# EAGLE schematic P14-ON-Off_Programmable (EAGLE 9.6.2)
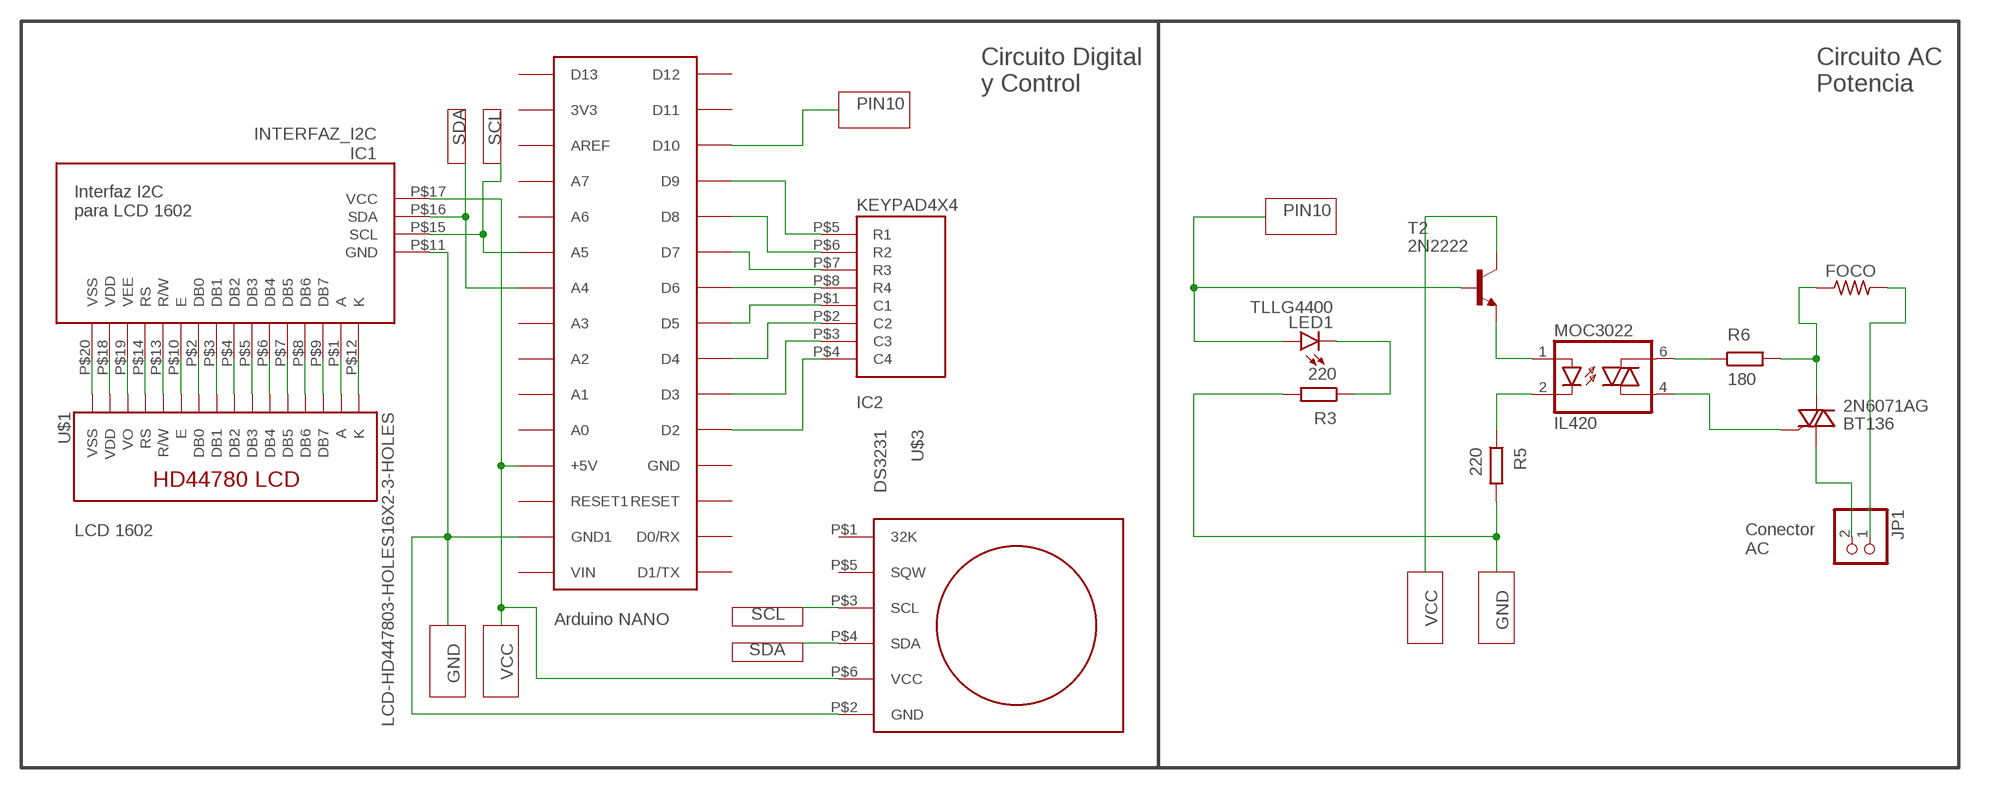
[diagram p0: schematic, sheet 1]

## Parts
2N6071AG  BT136  [TO220AB]
FOCO  R-US_0204/2V  [0204V]
IC1  INTERFAZ_I2C  [NO_FOOTPRINT]
IC2  KEYPAD4X4  [NO_FOOTPRINT]
JP1  PINHD-1X2/90  [1X02/90]
LED1  TLLG4400  [LED3MM]
MOC3022  IL420  [DIL06]
R3  220  R  (no package)
R5  220  R  (no package)
R6  180  R  (no package)
T2  2N2222  [TO18]
U$1  LCD-HD447803-HOLES16X2-3-HOLES  [LCD-16X2-3HOLES]
U$2  ARDUINONANO  [PDIP-32]
U$3  DS3231  [NOTFOOTPRINT]

## Nets
GND: IC1.P$11(GND) R3.2 R5.2 U$2.GND1 U$3.P$2(GND)
N$1: IC1.P$20(VSS) U$1.1(VSS)
N$2: IC1.P$18(VDD) U$1.2(VDD)
N$3: IC1.P$19(VEE) U$1.3(VO)
N$4: IC1.P$14(RS) U$1.4(RS)
N$5: IC1.P$13(R/W) U$1.5(R/W)
N$6: IC1.P$10(E) U$1.6(E)
N$7: IC1.P$2(DB0) U$1.7(DB0)
N$8: IC1.P$3(DB1) U$1.8(DB1)
N$9: IC1.P$4(DB2) U$1.9(DB2)
N$10: IC1.P$5(DB3) U$1.10(DB3)
N$11: IC1.P$6(DB4) U$1.11(DB4)
N$12: IC1.P$7(DB5) U$1.12(DB5)
N$13: IC1.P$8(DB6) U$1.13(DB6)
N$14: IC1.P$9(DB7) U$1.14(DB7)
N$15: IC1.P$12(K) U$1.16(K)
N$16: IC1.P$1(A) U$1.15(A)
N$17: IC2.P$4(C4) U$2.D2
N$18: IC2.P$3(C3) U$2.D3
N$19: IC2.P$2(C2) U$2.D4
N$20: IC2.P$1(C1) U$2.D5
N$21: IC2.P$8(R4) U$2.D6
N$22: IC2.P$7(R3) U$2.D7
N$23: IC2.P$6(R2) U$2.D8
N$24: IC2.P$5(R1) U$2.D9
N$31: LED1.K(C) R3.1
N$33: MOC3022.1(A) T2.1(E)
N$34: MOC3022.2(C) R5.1
N$35: 2N6071AG.3(G) MOC3022.4(A1)
N$36: MOC3022.6(A2) R6.1
N$37: 2N6071AG.2(A2) FOCO.1 R6.2
N$38: 2N6071AG.1(A1) JP1.2
N$39: FOCO.2 JP1.1
PIN10: LED1.A T2.2(B) U$2.D10
SCL: IC1.P$15(SCL) U$2.A5 U$3.P$3(SCL)
SDA: IC1.P$16(SDA) U$2.A4 U$3.P$4(SDA)
VCC: IC1.P$17(VCC) T2.3(C) U$2.+5V U$3.P$6(VCC)
Unconnected: U$2.3V3 U$2.A0 U$2.A1 U$2.A2 U$2.A3 U$2.A6 U$2.A7 U$2.AREF U$2.D0/RX U$2.D1/TX U$2.D11 U$2.D12 U$2.D13 U$2.GND U$2.RESET U$2.RESET1 U$2.VIN U$3.P$1(32K) U$3.P$5(SQW)

## Notes on the sheet
- Circuito Digital
  y Control
- Circuito AC
  Potencia
- Interfaz I2C
  para LCD 1602
- LCD 1602
- Conector
  AC
- Arduino NANO

## Library data of the parts
2N6071AG = triac:BT136: Triac BT136 series E sensitive gate Source: http://www.nxp.com/acrobat_download/datasheets/BT136_SERIES_E_2.pdf
FOCO = rcl:R-US_: RESISTOR, American symbol; SPICEPREFIX: R
IC1 = Interfaz_I2C:INTERFAZ_I2C
IC2 = keypad_4x4:KEYPAD4X4
JP1 = pinhead:PINHD-1X2: PIN HEADER
LED1 = led:TLLG4400: Low Current (2mA) LED 3 mm Tinted Diffused Package color GREEN Source: Data sheet <http://www.farnell.com/datasheets/391098.pdf>; MF: VISHAY SEMICONDUCTOR; OC_FARNELL: 1612435
MOC3022 = optocoupler:IL420: SIEMENS OPTO COUPLER; MF: VISHAY/TELEFUNKEN; MPN: IL420; OC_FARNELL: 1469561; OC_NEWARK: 58K1719
R3 R5 R6 = ngspice-simulation:R: RESISTOR
T2 = transistor:2N2222: NPN TRANSISTOR
U$1 = HD44780LCD:LCD-HD44780
U$2 = jet-lib:ARDUINONANO
U$3 = DS3231:DS3231